# EAGLE schematic Skematik Project Akhir (EAGLE 9.2.0)
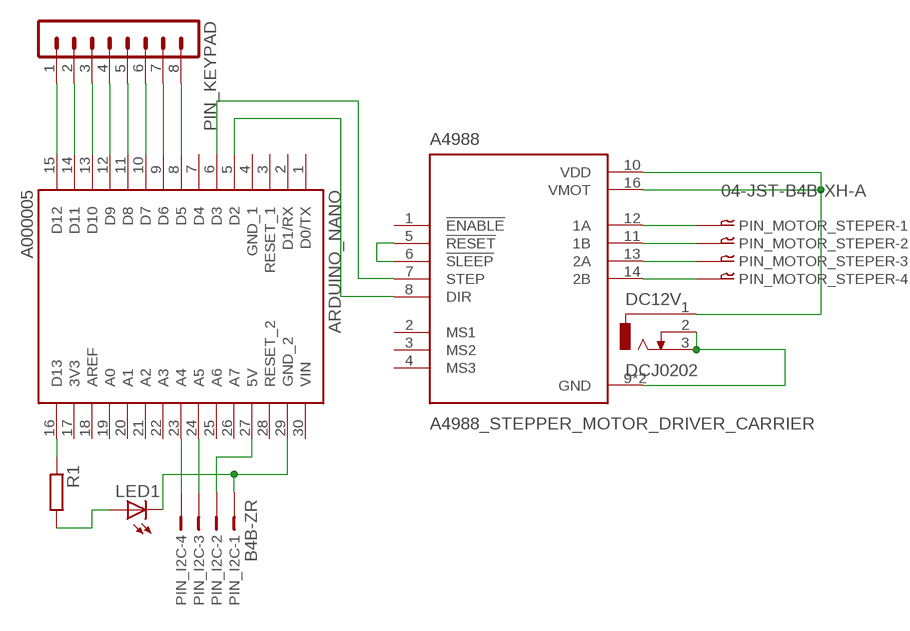
[diagram p0: schematic, sheet 1]

## Parts
A4988  A4988_STEPPER_MOTOR_DRIVER_CARRIER  [MODULE_A4988_STEPPER_MOTOR_DRIVER_CARRIER]
ARDUINO_NANO  A000005  [MODULE_A000005]
DC12V  DCJ0202  [DCJ0202]
LED1  LED3MM  [LED3MM]
PIN_I2C  B4B-ZR  [B4B-ZR]
PIN_KEYPAD  MA08-1  [MA08-1]
PIN_MOTOR_STEPER  04-JST-B4B-XH-A  [B4B-XH]
R1  R-EU_0207/10  [0207/10]

## Nets
N$1: ARDUINO_NANO.23(A4) PIN_I2C.4
N$2: ARDUINO_NANO.24(A5) PIN_I2C.3
N$3: ARDUINO_NANO.15(D12) PIN_KEYPAD.1
N$4: A4988.12(1A) PIN_MOTOR_STEPER.P$1
N$5: ARDUINO_NANO.14(D11) PIN_KEYPAD.2
N$6: ARDUINO_NANO.13(D10) PIN_KEYPAD.3
N$7: A4988.8(DIR) ARDUINO_NANO.5(D2)
N$8: A4988.7(STEP) ARDUINO_NANO.6(D3)
N$9: ARDUINO_NANO.12(D9) PIN_KEYPAD.4
N$10: ARDUINO_NANO.11(D8) PIN_KEYPAD.5
N$11: ARDUINO_NANO.10(D7) PIN_KEYPAD.6
N$12: ARDUINO_NANO.9(D6) PIN_KEYPAD.7
N$13: ARDUINO_NANO.8(D5) PIN_KEYPAD.8
N$14: ARDUINO_NANO.16(D13) R1.1
N$15: LED1.A R1.2
N$17: A4988.11(1B) PIN_MOTOR_STEPER.P$2
N$18: A4988.13(2A) PIN_MOTOR_STEPER.P$3
N$19: A4988.14(2B) PIN_MOTOR_STEPER.P$4
N$20: A4988.5(!RESET) A4988.6(!SLEEP)
N$21: A4988.10(VDD) A4988.16(VMOT) DC12V.1
N$22: A4988.9(GND) A4988.15(GND) DC12V.2 DC12V.3
N$24: ARDUINO_NANO.29(GND_2) LED1.K(C) PIN_I2C.1
N$25: ARDUINO_NANO.27(5V) PIN_I2C.2
Unconnected: A4988.1(!ENABLE) A4988.2(MS1) A4988.3(MS2) A4988.4(MS3) ARDUINO_NANO.1(D0/TX) ARDUINO_NANO.2(D1/RX) ARDUINO_NANO.3(RESET_1) ARDUINO_NANO.7(D4) ARDUINO_NANO.18(AREF) ARDUINO_NANO.19(A0) ARDUINO_NANO.20(A1) ARDUINO_NANO.21(A2) ARDUINO_NANO.22(A3) ARDUINO_NANO.25(A6) ARDUINO_NANO.26(A7) ARDUINO_NANO.28(RESET_2)

## Power pins joined to a net without a drawn wire
3V3: ARDUINO_NANO.17(3V3)
GND_1: ARDUINO_NANO.4(GND_1)
VIN: ARDUINO_NANO.30(VIN)

## Library data of the parts
A4988 = A4988_STEPPER_MOTOR_DRIVER_CARRIER:A4988_STEPPER_MOTOR_DRIVER_CARRIER: Stepper motor controler; IC: A4988; 1A; Uin mot: 8÷35V Check availability <https://pricing.snapeda.com/parts/A4988%20STEPPER%20MOTOR%20DRIVER%20CARRIER/Pololu/view-part?ref=eda>; AVAILABILITY: Not in stock; CHECK_PRICES: https://www.snapeda.com/parts/A4988%20STEPPER%20MOTOR%20DRIVER%20CARRIER/Pololu/view-part/?ref=eda; DESCRIPTION: Stepper Motor Driver; MF: Pololu; MP: A4988 STEPPER MOTOR DRIVER CARRIER; PACKAGE: None; PRICE: None; SNAPEDA_LINK: https://www.snapeda.com/parts/A4988%20STEPPER%20MOTOR%20DRIVER%20CARRIER/Pololu/view-part/?ref=snap
ARDUINO_NANO = A000005:A000005: CLOCK SAW OSCILLATOR SEAM7050 T& Check availability <https://pricing.snapeda.com/parts/A000005/Arduino/view-part?ref=eda>; AVAILABILITY: In Stock; CHECK_PRICES: https://www.snapeda.com/parts/A000005/Arduino/view-part/?ref=eda; DESCRIPTION: Arduino Nano Microcontroller Board, ATmega328 | Arduino A000005; MF: Arduino; MP: A000005; PACKAGE: Non-Standard Arduino; PRICE: None; PURCHASE-URL: https://www.snapeda.com/api/url_track_click_mouser/?unipart_id=41206&manufacturer=Arduino&part_name=A000005&search_term=arduino; SNAPEDA_LINK: https://www.snapeda.com/parts/A000005/Arduino/view-part/?ref=snap
DC12V = con-jack:DCJ0202: DC POWER JACK Source: DCJ0202.pdf; OC_FARNELL: unknown; OC_NEWARK: unknown
LED1 = led:LED: LED OSRAM: - CHIPLED LG R971, LG N971, LY N971, LG Q971, LY Q971, LO R971, LY R971 LH N974, LH R974 LS Q976, LO Q976, LY Q976 LO Q996 - Hyper CHIPLED LW Q18S LB Q993, LB Q99A, LB R99A - SideLED LS A670, LO A670, LY A670, LG A670, LP A670 LB A673, LV A673, LT A673, LW A673 LH A674 LY A675 LS A676, LA A676, LO A676, LY A676, LW A676 LS A679, LY A679, LG A679 - Hyper Micro SIDELED® LS Y876, LA Y876, LO Y876, LY Y876 LT Y87S - SmartLED LW L88C, LW L88S LB L89C, LB L89S, LG L890 LS L89K, LO L89K, LY L89K LS L896, LA L896, LO L896, LY L896 - TOPLED LS T670, LO T670, LY T670, LG T670, LP T670 LSG T670, LSP T670, LSY T670, LOP T670, LYG T670 LG T671, LOG T671, LSG T671 LB T673, LV T673, LT T673, LW T673 LH T674 LS T676, LA T676, LO T676, LY T676, LB T676, LH T676, LSB T676, LW T676 LB T67C, LV T67C, LT T67C, LS T67K, LO T67K, LY T67K, LW E67C LS E67B, LA E67B, LO E67B, LY E67B, LB E67C, LV E67C, LT E67C LW T67C LS T679, LY T679, LG T679 LS T770, LO T770, LY T770, LG T770, LP T770 LB T773, LV T773, LT T773, LW T773 LH T774 LS E675, LA E675, LY E675, LS T675 LS T776, LA T776, LO T776, LY T776, LB T776 LHGB T686 LT T68C, LB T68C - Hyper Mini TOPLED® LB M676 - Mini TOPLED Santana® LG M470 LS M47K, LO M47K, LY M47K Source: http://www.osram.convergy.de LUXEON: - LUMILED® LXK2-PW12-R00, LXK2-PW12-S00, LXK2-PW14-U00, LXK2-PW14-V00 LXK2-PM12-R00, LXK2-PM12-S00, LXK2-PM14-U00 LXK2-PE12-Q00, LXK2-PE12-R00, LXK2-PE12-S00, LXK2-PE14-T00, LXK2-PE14-U00 LXK2-PB12-K00, LXK2-PB12-L00, LXK2-PB12-M00, LXK2-PB14-N00, LXK2-PB14-P00, LXK2-PB14-Q00 LXK2-PR12-L00, LXK2-PR12-M00, LXK2-PR14-Q00, LXK2-PR14-R00 LXK2-PD12-Q00, LXK2-PD12-R00, LXK2-PD12-S00 LXK2-PH12-R00, LXK2-PH12-S00 LXK2-PL12-P00, LXK2-PL12-Q00, LXK2-PL12-R00 Source: www.luxeon.com KINGBRIGHT: KA-3528ASYC Source: www.kingbright.com
PIN_I2C = con-jst:?4B-ZR: ZH CONNECTOR 1.5 mm, 4 pin 1 row Source: http://www.jst.com .. eZH.pdf; MF: FARNELL; MPN: B4B-ZR(LF)(SN); OC_FARNELL: 1830916; OC_NEWARK: 37K9960
PIN_KEYPAD = con-lstb:MA08-1: PIN HEADER; OC_FARNELL: unknown; OC_NEWARK: unknown
PIN_MOTOR_STEPER = bt_con-jst-xh:04-JST: JST CONNECTOR
R1 = rcl:R-EU_: RESISTOR, European symbol; SPICEPREFIX: R